# Altium schematic sheet REGENIX_RS485.SchDoc
size Tabloid; Date: Date; Author: Author 1; DocumentNumber: 3; Revision: 1; SheetNumber: 4; SheetTotal: 17; Size: 11x17; Sheet_Name: RS485
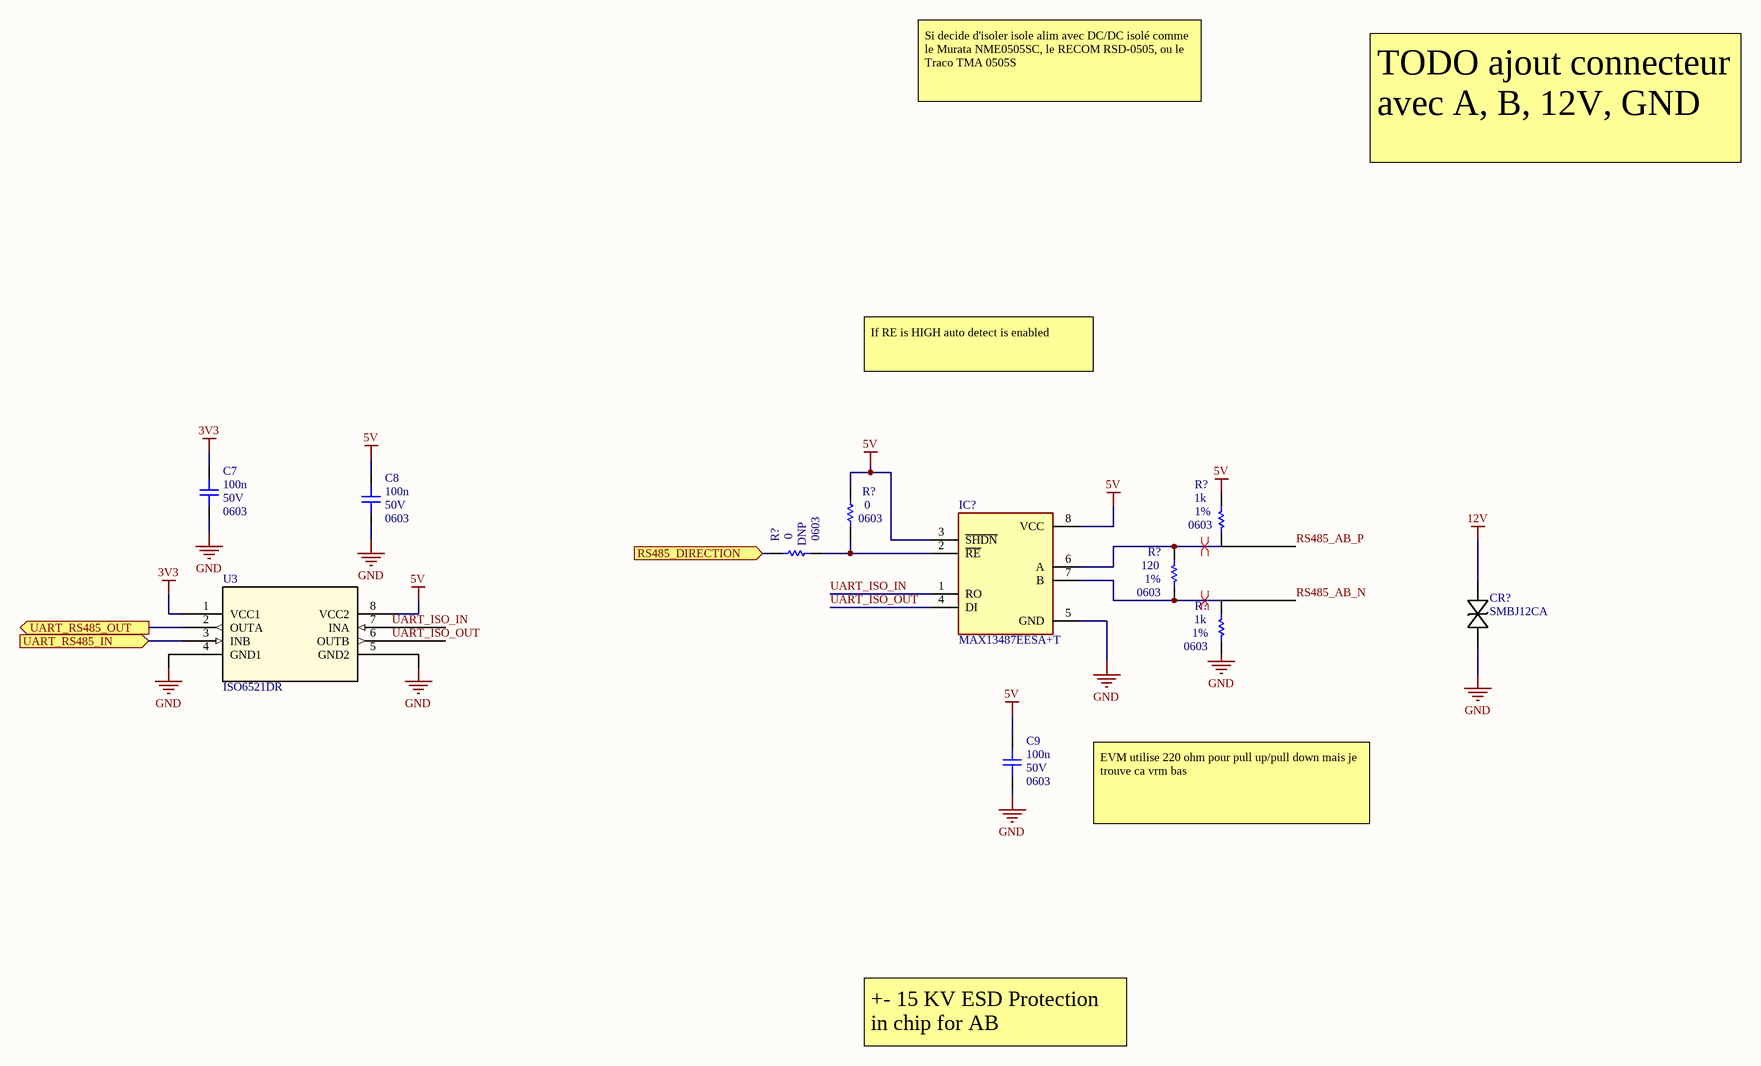
[diagram p0: REGENIX_RS485.SchDoc]

## Parts
(Parts that share a designator on the sheet are numbered #1, #2 ... from top to bottom, then left to right.)
C7  value 100n  Voltage: 50V  Package: 0603  [CAP_0603]  (hidden comment: CAP - 0603)
C8  value 100n  Voltage: 50V  Package: 0603  [CAP_0603]  (hidden comment: CAP - 0603)
C9  value 100n  Voltage: 50V  Package: 0603  [CAP_0603]  (hidden comment: CAP - 0603)
CR?  SMBJ12CA  [SMBJSeries_LTF]
IC?  MAX13487EESA+T  [SOIC127P600X175-8N]
R?#1  value 0  Package: 0603  [RES_0603]  (hidden comment: RES - 0603)
R?#2  value 1k  Package: 0603  Precision: 1%  [RES_0603]  (hidden comment: RES - 0603)
R?#3  value 0  NI: DNP  Package: 0603  [RES_0603]  (hidden comment: RES - 0603)
R?#4  value 120  Package: 0603  Precision: 1%  [RES_0603]  (hidden comment: RES - 0603)
R?#5  value 1k  Package: 0603  Precision: 1%  [RES_0603]  (hidden comment: RES - 0603)
U3  ISO6521DR  [SOIC8_D_TEX]

## Ports
RS485_DIRECTION (in), UART_RS485_IN (in), UART_RS485_OUT (out)

## Nets
3V3: C7.2 U3.1(VCC1)
5V: C8.2 C9.2 IC?.3(~{SHDN}) IC?.8(VCC) R?#1.2 R?#2.2 U3.8(VCC2)
12V: CR?.1
GND: C7.1 C8.1 C9.1 CR?.2 IC?.5(GND)
RS485_DIRECTION: R?#3.2 ; port RS485_DIRECTION
UART_ISO_IN: IC?.1(RO)
UART_ISO_OUT: IC?.4(DI)
UART_RS485_IN: U3.3(INB) ; port UART_RS485_IN
UART_RS485_OUT: U3.2(OUTA) ; port UART_RS485_OUT
NetIC?_2: IC?.2(~{RE}) R?#1.1 R?#3.1
NetIC?_6: IC?.6(A) R?#2.1 R?#4.2
NetIC?_7: IC?.7(B) R?#4.1 R?#5.2

Not connected (* = marked no-connect by the designer): R?#5 1; U3 4(GND1) 5(GND2) 6(OUTB) 7(INA)

## Layout directives
differential pair: NetIC?_6, NetIC?_7

## Notes on the sheet
- Si decide d'isoler isole alim avec DC/DC isolé comme le Murata NME0505SC, le RECOM RSD-0505, ou le Traco TMA 0505S
- TODO ajout connecteur avec A, B, 12V, GND
- If RE is HIGH auto detect is enabled
- EVM utilise 220 ohm pour pull up/pull down mais je trouve ca vrm bas
- +- 15 KV ESD Protection in chip for AB
- Labels drawn without touching a wire or pin: GND, RS485_AB_N, RS485_AB_P, UART_ISO_IN, UART_ISO_OUT
- Sheet Name
- Project Title
- Global Project
- Revision
- Size
- Date
- Group
- Sheet
- of
- Filename
- Designers

## Library data of the parts
C7-C9 = CAP - 0603: Precision: 10%; Current: *; CreatedBy: Jonathan Bouchard; Power: *
CR? = SMBJ12CA: No Description Available; Mfr_Name: Littelfuse Inc
IC? = MAX13487EESA+T: Integrated Circuit; Manufacturer_Name: Analog Devices; Datasheet Link: https://datasheets.maximintegrated.com/en/ds/MAX13487E-MAX13488E.pdf; Height: 1.75mm; Manufacturer_Part_Number: MAX13487EESA+T; Mouser Part Number: 700-MAX13487EESAT; Mouser Price/Stock: https://www.mouser.co.uk/ProductDetail/Analog-Devices-Maxim-Integrated/MAX13487EESA%2bT?qs=CDqwynd4ZNqR%252BznpqLLGdQ%3D%3D; Arrow Part Number: MAX13487EESA+T; Arrow Price/Stock: https://www.arrow.com/en/products/max13487eesat/analog-devices?utm_currency=USD&region=nac
R?#1 R?#3 = RES - 0603: Precision: 1%; Current: *; CreatedBy: Jonathan Bouchard
U3 = ISO6521DR: No Description Available; Mfr_Name: Texas Instruments; RefDes: RefDes; Type: Type
R?#2 R?#4 R?#5 = RES - 0603: Current: *; CreatedBy: Jonathan Bouchard